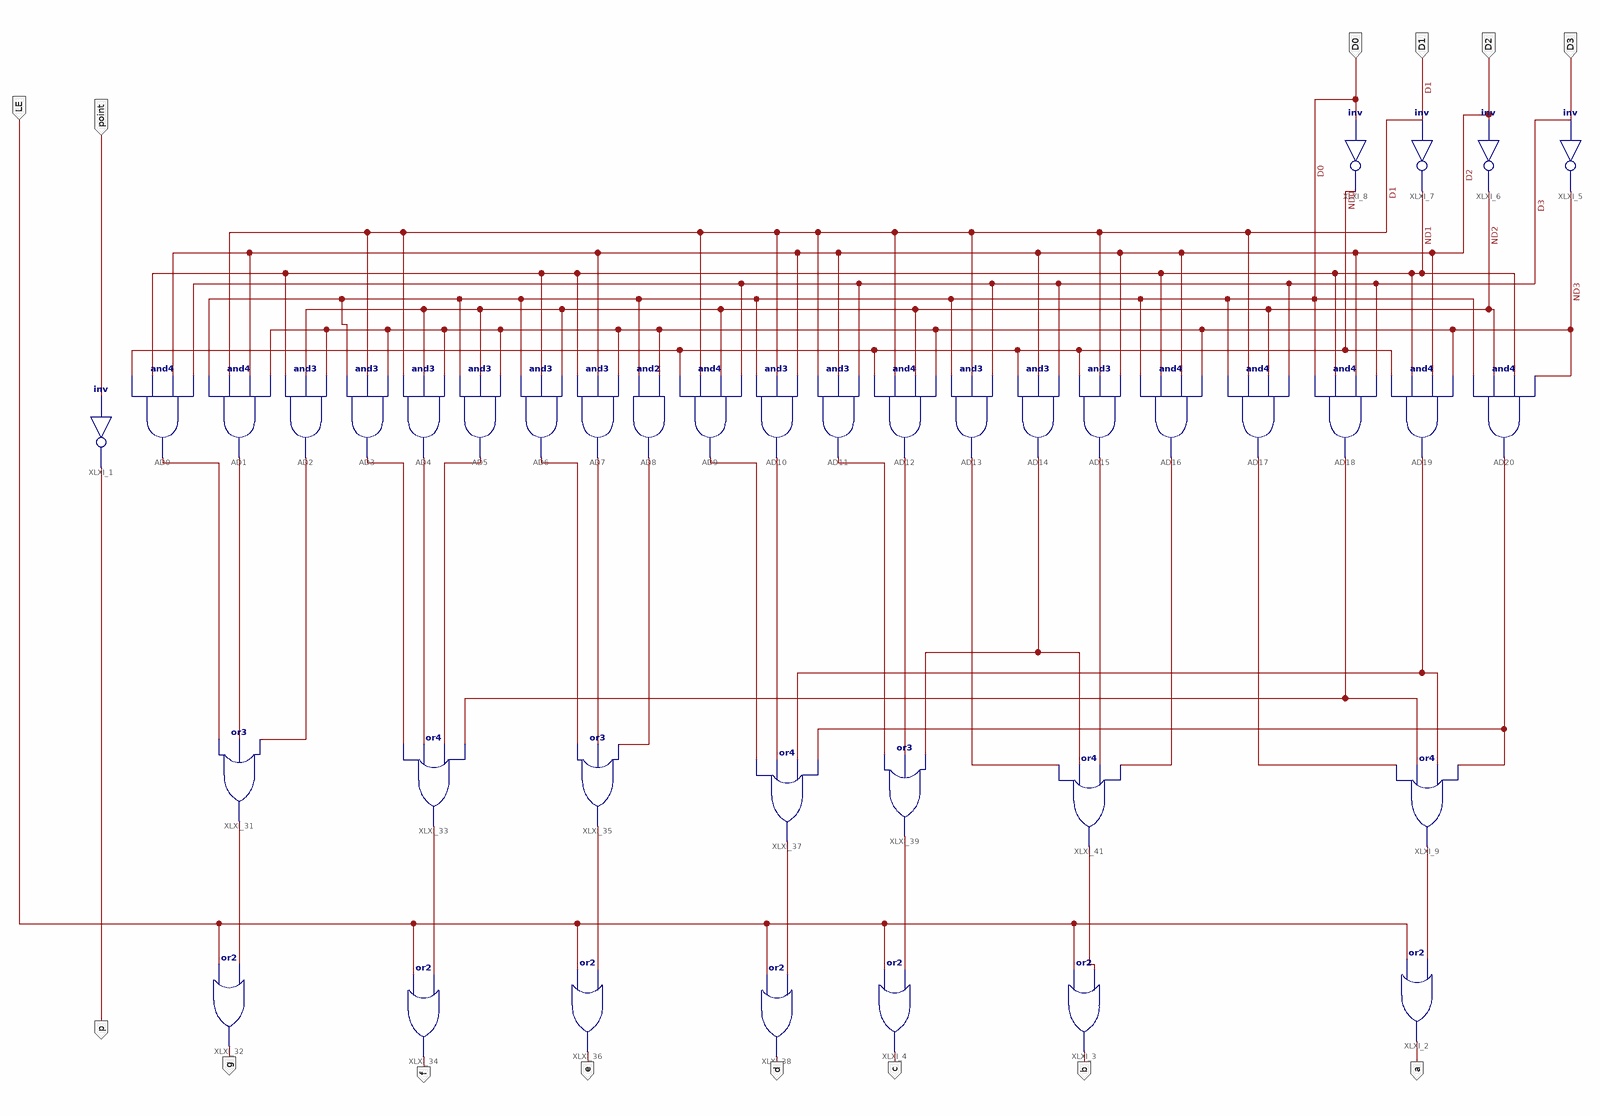
[diagram p0: schematic sheet 1]
// Xilinx ISE schematic MyMC14495.sch (kintex7) as structural Verilog: 40 symbols, 14 ports
module MyMC14495 (
  input  point,
  input  LE,
  input  D3,
  input  D2,
  input  D1,
  input  D0,
  output p,
  output a,
  output b,
  output c,
  output d,
  output e,
  output f,
  output g
);

  wire ND0, ND1, ND2, ND3, XLXN_12, XLXN_30, XLXN_31, XLXN_32, XLXN_35, XLXN_41, XLXN_43, XLXN_46, XLXN_48,
       XLXN_58, XLXN_59, XLXN_60, XLXN_61, XLXN_63, XLXN_64, XLXN_65, XLXN_66, XLXN_67, XLXN_68, XLXN_69,
       XLXN_71, XLXN_72, XLXN_74, XLXN_75, XLXN_76, XLXN_79, XLXN_102, XLXN_106;

  not XLXI_1 (p, point);
  or XLXI_3 (b, LE, XLXN_30);
  or XLXI_2 (a, LE, XLXN_12);
  not XLXI_5 (ND3, D3);
  not XLXI_6 (ND2, D2);
  not XLXI_7 (ND1, D1);
  not XLXI_8 (ND0, D0);
  and AD0 (XLXN_79, ND0, ND1, D2, D3);
  and AD1 (XLXN_106, D0, D1, D2, ND3);
  and AD2 (XLXN_102, ND1, ND2, ND3);
  and AD3 (XLXN_76, D0, D1, ND3);
  and AD4 (XLXN_75, D1, ND2, ND3);
  and AD5 (XLXN_74, D0, ND2, ND3);
  and AD6 (XLXN_72, D0, ND1, ND2);
  and AD7 (XLXN_71, ND1, D2, ND3);
  and AD8 (XLXN_69, D0, ND3);
  and AD9 (XLXN_68, ND0, D1, ND2, D3);
  and AD10 (XLXN_67, D0, D1, D2);
  and AD11 (XLXN_66, D1, D2, D3);
  and AD12 (XLXN_65, ND0, D1, ND2, ND3);
  and AD13 (XLXN_64, D0, D1, D3);
  and AD14 (XLXN_63, ND0, D2, D3);
  and AD15 (XLXN_61, ND0, D1, D2);
  and AD16 (XLXN_60, D0, ND1, D2, ND3);
  and AD17 (XLXN_59, D0, D1, ND2, D3);
  and AD18 (XLXN_58, D0, ND1, D2, D3);
  and AD19 (XLXN_32, ND0, ND1, D2, ND3);
  and AD20 (XLXN_31, D0, ND2, ND1, ND3);
  or XLXI_9 (XLXN_12, XLXN_59, XLXN_58, XLXN_32, XLXN_31);
  or XLXI_31 (XLXN_41, XLXN_79, XLXN_106, XLXN_102);
  or XLXI_32 (g, LE, XLXN_41);
  or XLXI_33 (XLXN_35, XLXN_76, XLXN_75, XLXN_74, XLXN_58);
  or XLXI_34 (f, LE, XLXN_35);
  or XLXI_35 (XLXN_43, XLXN_72, XLXN_71, XLXN_69);
  or XLXI_36 (e, LE, XLXN_43);
  or XLXI_37 (XLXN_46, XLXN_68, XLXN_67, XLXN_32, XLXN_31);
  or XLXI_38 (d, LE, XLXN_46);
  or XLXI_39 (XLXN_48, XLXN_66, XLXN_65, XLXN_63);
  or XLXI_4 (c, LE, XLXN_48);
  or XLXI_41 (XLXN_30, XLXN_64, XLXN_63, XLXN_61, XLXN_60);
endmodule
